# EAGLE board reg-board (EAGLE 8.7.0), part 1 of 2
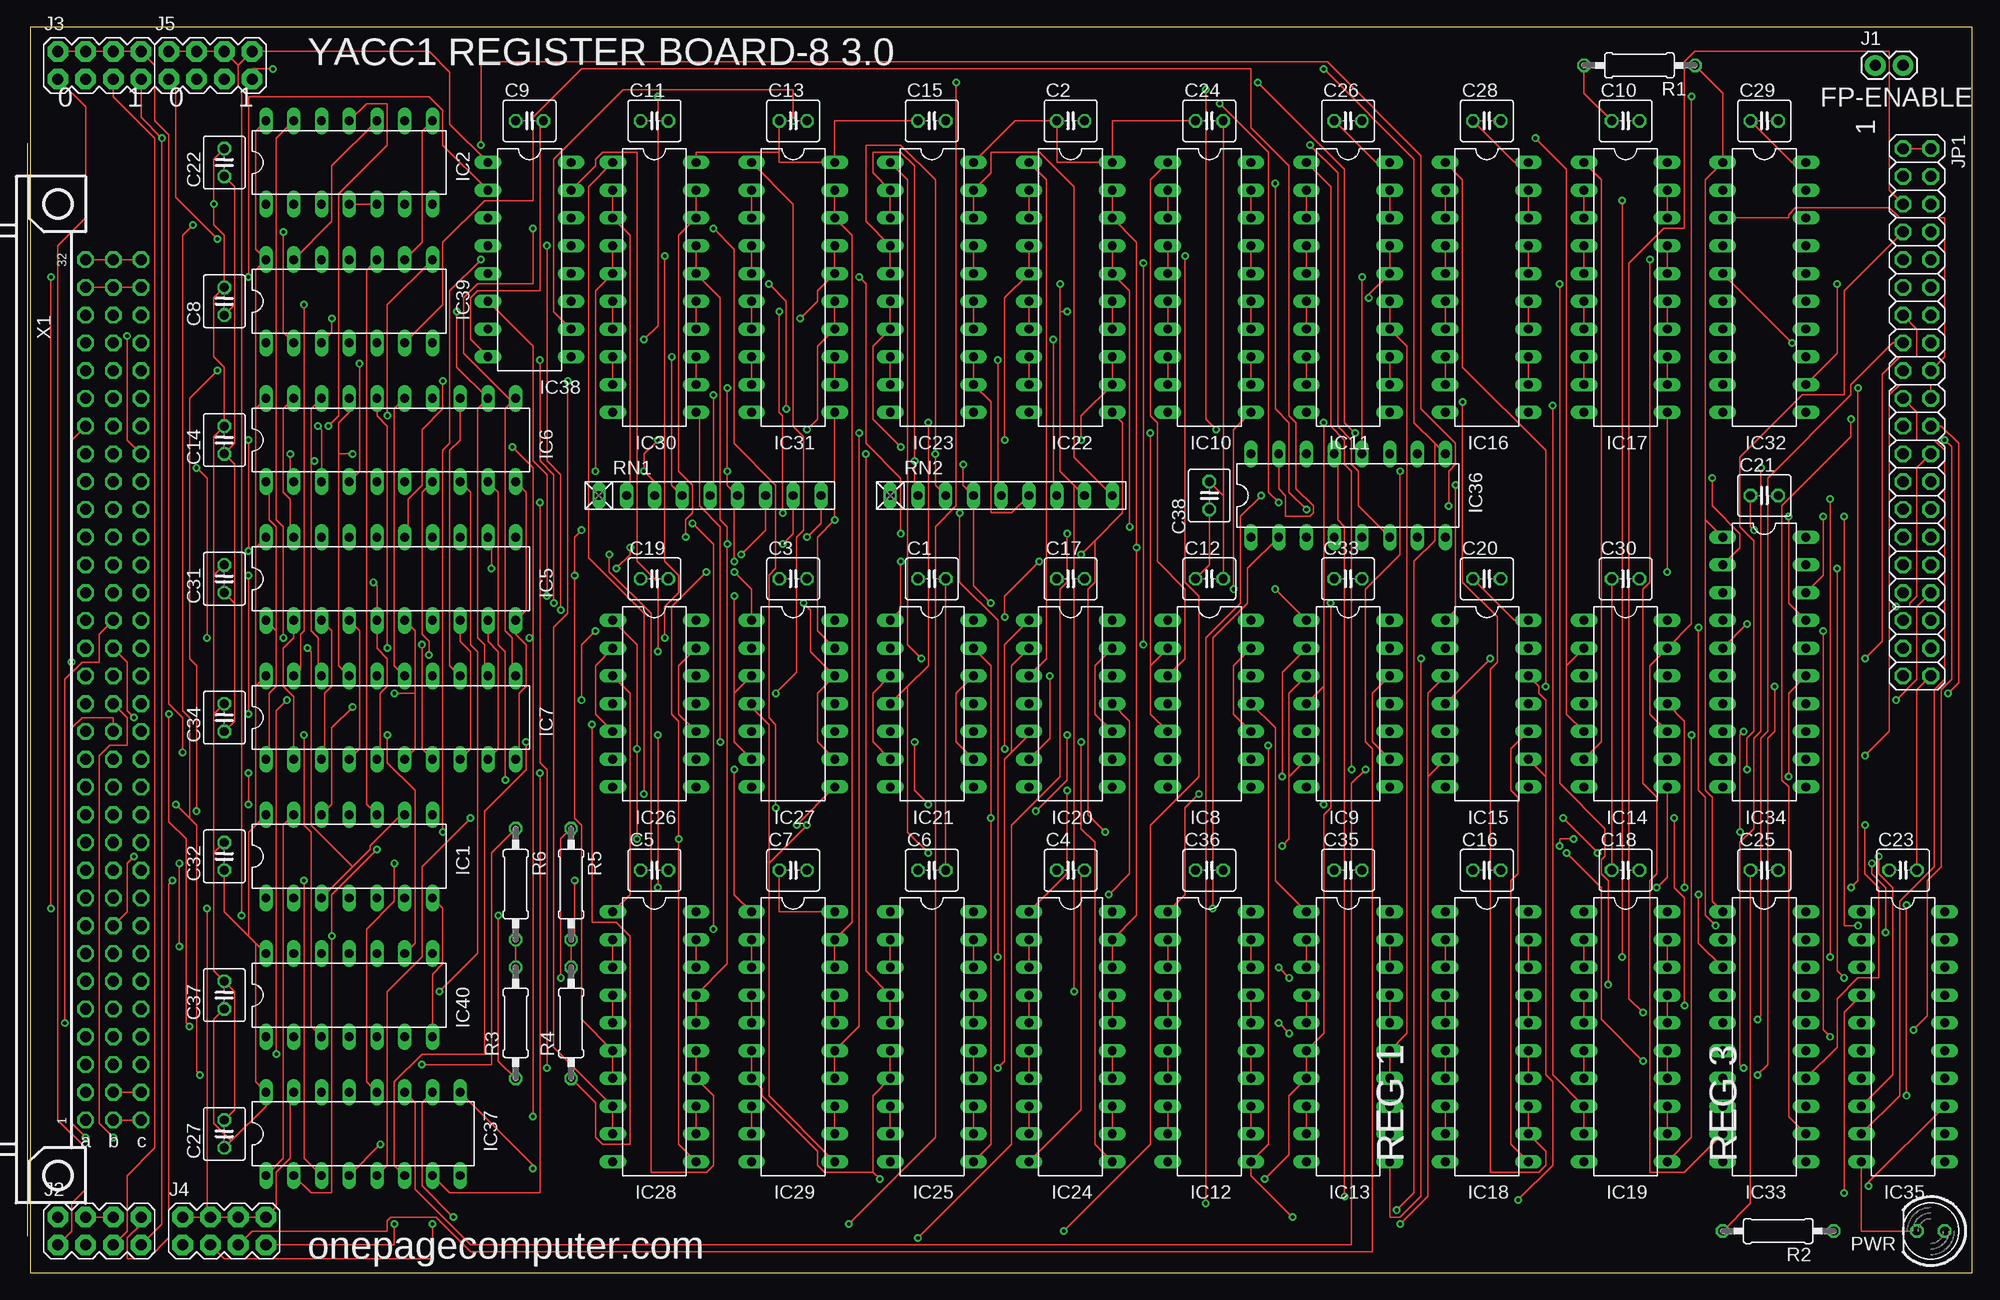
[diagram p6: board, top side]
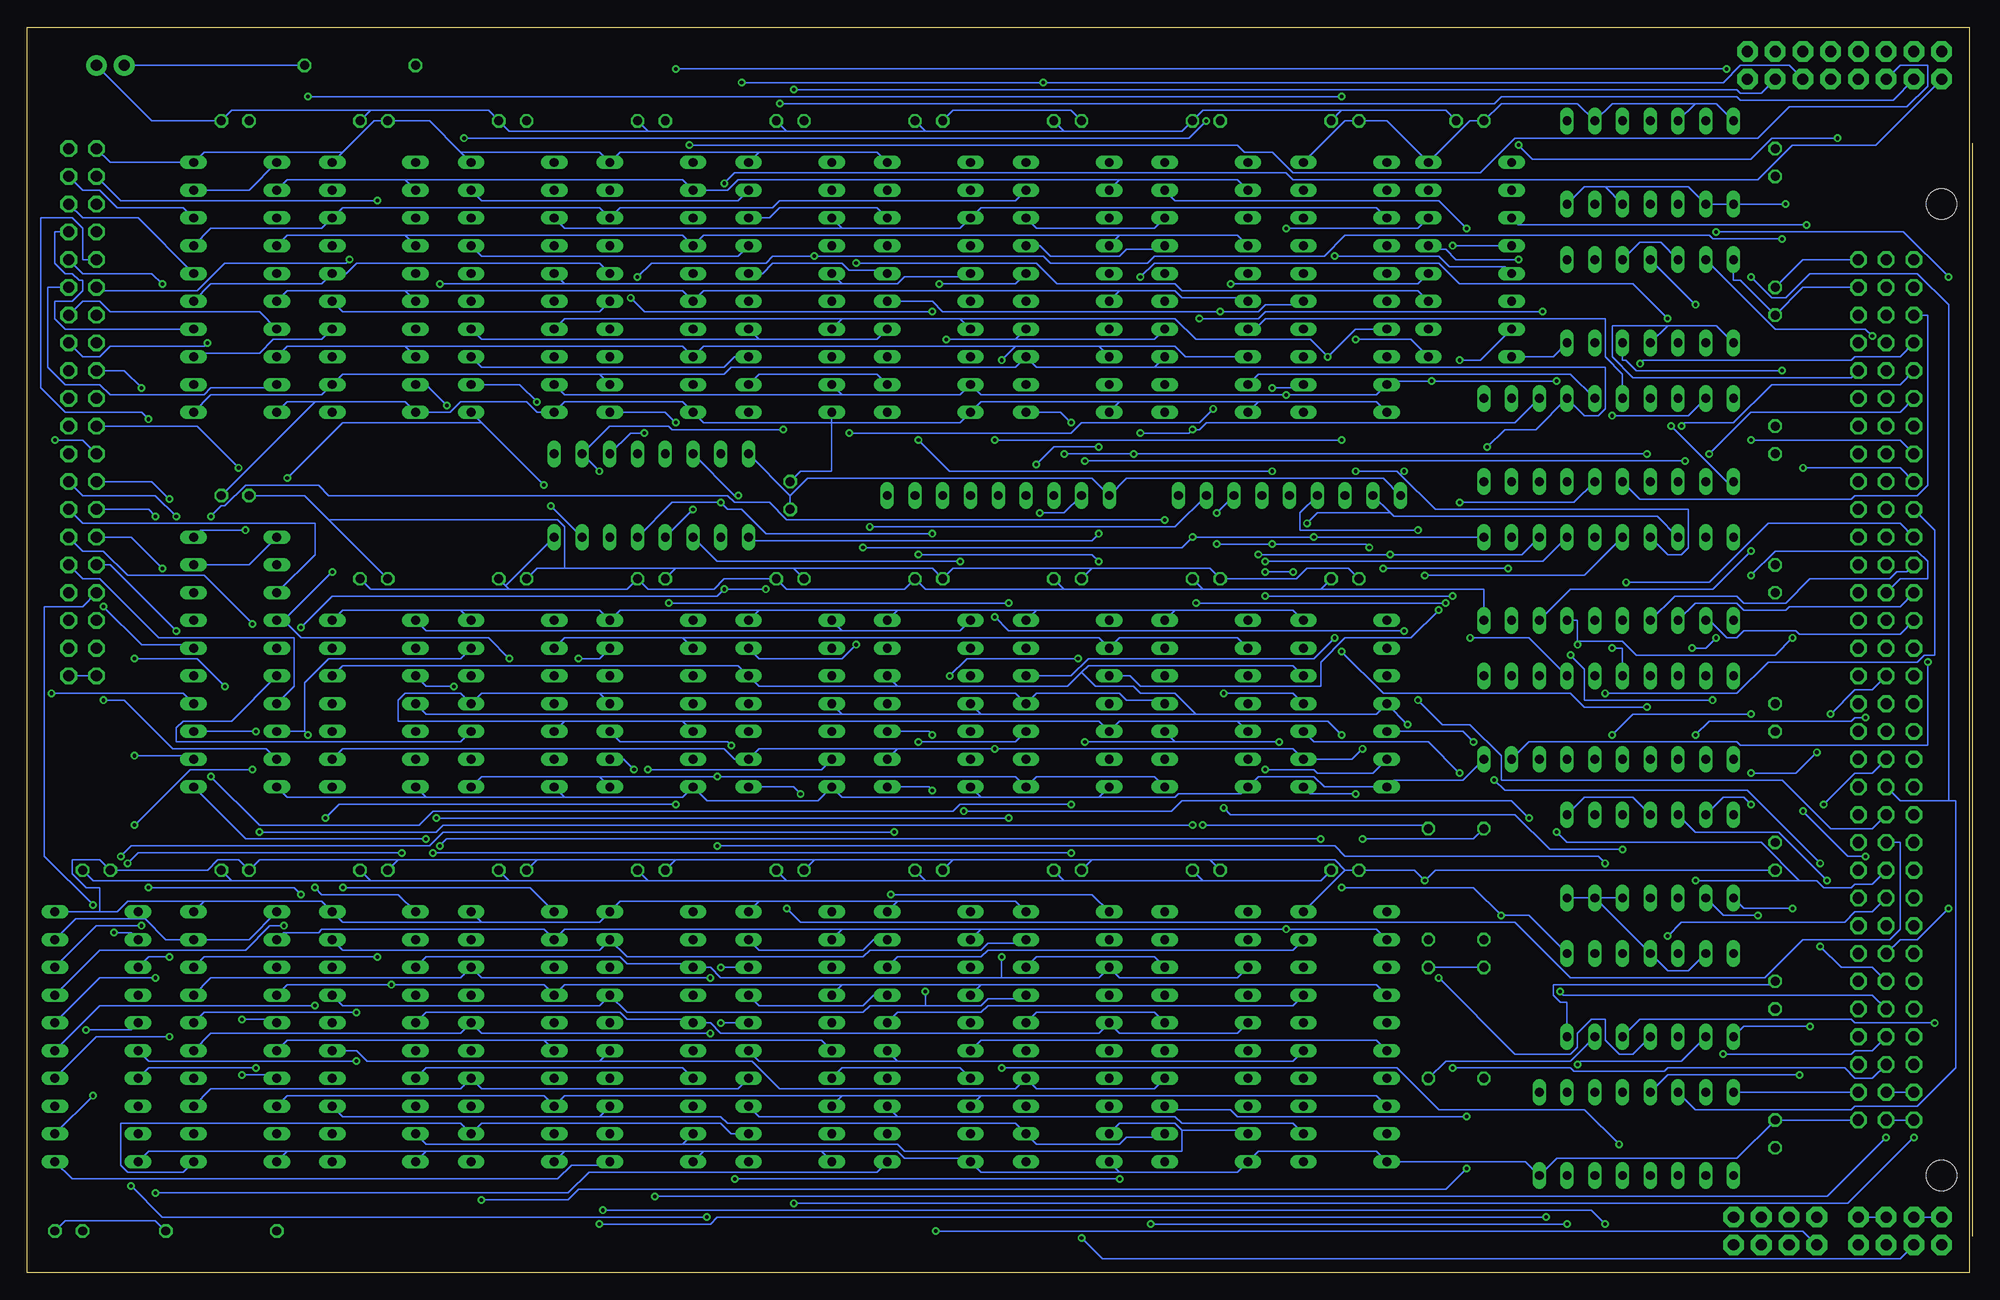
[diagram p7: board, bottom side, seen from below]

Size 177.78 x 113.97 mm. Coordinates in mm from the lower left corner, seen from the top.
Outline: 0,0 177.78,0 177.78,113.97 0,113.97 0,0
Copper layers (1*16): Top 0.0356mm / dielectric 1.5011mm / Bottom 0.0356mm
Design rules "LaenPCBOrder *": minimum track width 6mil, minimum drill 13mil, track to track 8mil, track to pad 8mil, pad to pad 8mil, via to via 8mil, smd to smd 6mil, copper to edge 40mil, drill to drill 8mil, minimum pad ring 7mil, minimum via ring 7mil, stop-mask expansion 3mil, vias tented up to drill 0mil, thermal gap 10mil
Net classes: 1 GND: width 1 mm; 2 5V: width 1 mm

## Footprints (pad centres in the part's own frame; a part is rotated, then mirrored left to right if it is on the bottom)
C025-040X050 = drill 0.813 octagon: 1 -1.27,0; 2 1.27,0
DIL14 = drill 0.813 long: 1 -7.62,-3.81; 2 -5.08,-3.81; 3 -2.54,-3.81; 4 0,-3.81; 5 2.54,-3.81; 6 5.08,-3.81; 7 7.62,-3.81; 8 7.62,3.81; 9 5.08,3.81; 10 2.54,3.81; 11 0,3.81; 12 -2.54,3.81; 13 -5.08,3.81; 14 -7.62,3.81
DIL20 = drill 0.813 long: 1 -11.43,-3.81; 2 -8.89,-3.81; 3 -6.35,-3.81; 4 -3.81,-3.81; 5 -1.27,-3.81; 6 1.27,-3.81; 7 3.81,-3.81; 8 6.35,-3.81; 9 8.89,-3.81; 10 11.43,-3.81; 11 11.43,3.81; 12 8.89,3.81; 13 6.35,3.81; 14 3.81,3.81; 15 1.27,3.81; 16 -1.27,3.81; 17 -3.81,3.81; 18 -6.35,3.81; 19 -8.89,3.81; 20 -11.43,3.81
DIL16 = drill 0.813 long: 1 -8.89,-3.81; 2 -6.35,-3.81; 3 -3.81,-3.81; 4 -1.27,-3.81; 5 1.27,-3.81; 6 3.81,-3.81; 7 6.35,-3.81; 8 8.89,-3.81; 9 8.89,3.81; 10 6.35,3.81; 11 3.81,3.81; 12 1.27,3.81; 13 -1.27,3.81; 14 -3.81,3.81; 15 -6.35,3.81; 16 -8.89,3.81
1X02 = drill 1.016 pad 1.88: 1 0,0; 2 2.54,0
2X4 = drill 1.016 pad 1.88 octagon: 1 -3.81,-1.27; 2 -3.81,1.27; 3 -1.27,-1.27; 4 -1.27,1.27; 5 1.27,-1.27; 6 1.27,1.27; 7 3.81,-1.27; 8 3.81,1.27
2X20 = drill 1.016 octagon: 1 -24.13,-1.27; 2 -24.13,1.27; 3 -21.59,-1.27; 4 -21.59,1.27; 5 -19.05,-1.27; 6 -19.05,1.27; 7 -16.51,-1.27; 8 -16.51,1.27; 9 -13.97,-1.27; 10 -13.97,1.27; 11 -11.43,-1.27; 12 -11.43,1.27; 13 -8.89,-1.27; 14 -8.89,1.27; 15 -6.35,-1.27; 16 -6.35,1.27; 17 -3.81,-1.27; 18 -3.81,1.27; 19 -1.27,-1.27; 20 -1.27,1.27; 21 1.27,-1.27; 22 1.27,1.27; 23 3.81,-1.27; 24 3.81,1.27; 25 6.35,-1.27; 26 6.35,1.27; 27 8.89,-1.27; 28 8.89,1.27; 29 11.43,-1.27; 30 11.43,1.27; 31 13.97,-1.27; 32 13.97,1.27; 33 16.51,-1.27; 34 16.51,1.27; 35 19.05,-1.27; 36 19.05,1.27; 37 21.59,-1.27; 38 21.59,1.27; 39 24.13,-1.27; 40 24.13,1.27
LED5MM = drill 0.813 octagon: A -1.27,0; K 1.27,0
0207/10 = drill 0.813 octagon: 1 -5.08,0; 2 5.08,0
RN-9 = drill 0.813 long: 1 -10.16,0; 2 -7.62,0; 3 -5.08,0; 4 -2.54,0; 5 0,0; 6 2.54,0; 7 5.08,0; 8 7.62,0; 9 10.16,0
FABC96R = drill 1.016 octagon: A1 -2.54,39.37; A2 -2.54,36.83; A3 -2.54,34.29; A4 -2.54,31.75; A5 -2.54,29.21; A6 -2.54,26.67; A7 -2.54,24.13; A8 -2.54,21.59; A9 -2.54,19.05; A10 -2.54,16.51; A11 -2.54,13.97; A12 -2.54,11.43; A13 -2.54,8.89; A14 -2.54,6.35; A15 -2.54,3.81; A16 -2.54,1.27; A17 -2.54,-1.27; A18 -2.54,-3.81; A19 -2.54,-6.35; A20 -2.54,-8.89; A21 -2.54,-11.43; A22 -2.54,-13.97; A23 -2.54,-16.51; A24 -2.54,-19.05; A25 -2.54,-21.59; A26 -2.54,-24.13; A27 -2.54,-26.67; A28 -2.54,-29.21; A29 -2.54,-31.75; A30 -2.54,-34.29; A31 -2.54,-36.83; A32 -2.54,-39.37; B1 -5.08,39.37; B2 -5.08,36.83; B3 -5.08,34.29; B4 -5.08,31.75; B5 -5.08,29.21; B6 -5.08,26.67; B7 -5.08,24.13; B8 -5.08,21.59; B9 -5.08,19.05; B10 -5.08,16.51; B11 -5.08,13.97; B12 -5.08,11.43; B13 -5.08,8.89; B14 -5.08,6.35; B15 -5.08,3.81; B16 -5.08,1.27; B17 -5.08,-1.27; B18 -5.08,-3.81; B19 -5.08,-6.35; B20 -5.08,-8.89; B21 -5.08,-11.43; B22 -5.08,-13.97; B23 -5.08,-16.51; B24 -5.08,-19.05; B25 -5.08,-21.59; B26 -5.08,-24.13; B27 -5.08,-26.67; B28 -5.08,-29.21; B29 -5.08,-31.75; B30 -5.08,-34.29; B31 -5.08,-36.83; B32 -5.08,-39.37; C1 -7.62,39.37; C2 -7.62,36.83; C3 -7.62,34.29; C4 -7.62,31.75; C5 -7.62,29.21; C6 -7.62,26.67; C7 -7.62,24.13; C8 -7.62,21.59; C9 -7.62,19.05; C10 -7.62,16.51; C11 -7.62,13.97; C12 -7.62,11.43; C13 -7.62,8.89; C14 -7.62,6.35; C15 -7.62,3.81; C16 -7.62,1.27; C17 -7.62,-1.27; C18 -7.62,-3.81; C19 -7.62,-6.35; C20 -7.62,-8.89; C21 -7.62,-11.43; C22 -7.62,-13.97; C23 -7.62,-16.51; C24 -7.62,-19.05; C25 -7.62,-21.59; C26 -7.62,-24.13; C27 -7.62,-26.67; C28 -7.62,-29.21; C29 -7.62,-31.75; C30 -7.62,-34.29; C31 -7.62,-36.83; C32 -7.62,-39.37 | hole 2.794: 0,-44.456; 0,44.456

## Placement (x,y rotation side)
C1  .1uf  [C025-040X050]  82.55,63.5 0 top
C2  .1uf  [C025-040X050]  95.25,105.41 0 top
C3  .1uf  [C025-040X050]  69.85,63.5 0 top
C4  .1uf  [C025-040X050]  95.25,36.83 0 top
C5  .1uf  [C025-040X050]  57.15,36.83 0 top
C6  .1uf  [C025-040X050]  82.55,36.83 0 top
C7  .1uf  [C025-040X050]  69.85,36.83 0 top
C8  .1uf  [C025-040X050]  17.78,88.9 90 top
C9  .1uf  [C025-040X050]  45.72,105.41 0 top
C10  .1if  [C025-040X050]  146.05,105.41 0 top
C11  .1uf  [C025-040X050]  57.15,105.41 0 top
C12  .1uf  [C025-040X050]  107.95,63.5 0 top
C13  .1uf  [C025-040X050]  69.85,105.41 0 top
C14  .1uf  [C025-040X050]  17.78,76.2 90 top
C15  .1uf  [C025-040X050]  82.55,105.41 0 top
C16  .1uf  [C025-040X050]  133.35,36.83 0 top
C17  .1uf  [C025-040X050]  95.25,63.5 0 top
C18  .1uf  [C025-040X050]  146.05,36.83 0 top
C19  .1uf  [C025-040X050]  57.15,63.5 0 top
C20  .1uf  [C025-040X050]  133.35,63.5 0 top
C21  .1uf  [C025-040X050]  158.75,71.12 0 top
C22  .1uf  [C025-040X050]  17.78,101.6 90 top
C23  .1uf  [C025-040X050]  171.45,36.83 0 top
C24  .1uf  [C025-040X050]  107.95,105.41 0 top
C25  .1uf  [C025-040X050]  158.75,36.83 0 top
C26  .1uf  [C025-040X050]  120.65,105.41 0 top
C27  .1uf  [C025-040X050]  17.78,12.7 90 top
C28  .1uf  [C025-040X050]  133.35,105.41 0 top
C29  .1uf  [C025-040X050]  158.75,105.41 0 top
C30  .1uf  [C025-040X050]  146.05,63.5 0 top
C31  .1uf  [C025-040X050]  17.78,63.5 90 top
C32  .1uf  [C025-040X050]  17.78,38.1 90 top
C33  .1uf  [C025-040X050]  120.65,63.5 0 top
C34  .1uf  [C025-040X050]  17.78,50.8 90 top
C35  .1uf  [C025-040X050]  120.65,36.83 0 top
C36  .1uf  [C025-040X050]  107.95,36.83 0 top
C37  .1uf  [C025-040X050]  17.78,25.4 90 top
C38  .1uf  [C025-040X050]  107.95,71.12 90 top
IC1  74LS266N  [DIL14]  29.21,38.1 0 top
IC2  74LS86N  [DIL14]  29.21,101.6 0 top
IC5  74LS245N  [DIL20]  33.02,63.5 0 top
IC6  74LS245N  [DIL20]  33.02,76.2 0 top
IC7  74LS245N  [DIL20]  33.02,50.8 0 top
IC8  7432N  [DIL14]  107.95,52.07 270 top
IC9  74LS02N  [DIL14]  120.65,52.07 270 top
IC10  74S374N  [DIL20]  107.95,90.17 270 top
IC11  74S374N  [DIL20]  120.65,90.17 270 top
IC12  74S374N  [DIL20]  107.95,21.59 270 top
IC13  74S374N  [DIL20]  120.65,21.59 270 top
IC14  7432N  [DIL14]  146.05,52.07 270 top
IC15  74LS02N  [DIL14]  133.35,52.07 270 top
IC16  74S374N  [DIL20]  133.35,90.17 270 top
IC17  74S374N  [DIL20]  146.05,90.17 270 top
IC18  74S374N  [DIL20]  133.35,21.59 270 top
IC19  74S374N  [DIL20]  146.05,21.59 270 top
IC20  7432N  [DIL14]  95.25,52.07 270 top
IC21  74LS02N  [DIL14]  82.55,52.07 270 top
IC22  74S374N  [DIL20]  95.25,90.17 270 top
IC23  74S374N  [DIL20]  82.55,90.17 270 top
IC24  74S374N  [DIL20]  95.25,21.59 270 top
IC25  74S374N  [DIL20]  82.55,21.59 270 top
IC26  7432N  [DIL14]  57.15,52.07 270 top
IC27  74LS02N  [DIL14]  69.85,52.07 270 top
IC28  74S374N  [DIL20]  57.15,21.59 270 top
IC29  74S374N  [DIL20]  69.85,21.59 270 top
IC30  74S374N  [DIL20]  57.15,90.17 270 top
IC31  74S374N  [DIL20]  69.85,90.17 270 top
IC32  74LS244N  [DIL20]  158.75,90.17 270 top
IC33  74LS244N  [DIL20]  158.75,21.59 270 top
IC34  74LS244N  [DIL20]  158.75,55.88 270 top
IC35  74LS244N  [DIL20]  171.45,21.59 270 top
IC36  74LS139N  [DIL16]  120.65,71.12 0 top
IC37  74LS139N  [DIL16]  30.48,12.7 0 top
IC38  74LS139N  [DIL16]  45.72,92.71 270 top
IC39  74LS32N  [DIL14]  29.21,88.9 0 top
IC40  74LS07N  [DIL14]  29.21,25.4 0 top
J1  [1X02]  168.91,110.49 0 top
J2  [2X4]  6.35,3.81 0 top
J3  [2X4]  6.35,110.49 0 top
J4  [2X4]  17.78,3.81 0 top
J5  [2X4]  16.51,110.49 0 top
JP1  [2X20]  172.72,78.74 270 top
PWR  [LED5MM]  173.99,3.81 180 top
R1  10k  [0207/10]  147.32,110.49 180 top
R2  330  [0207/10]  160.02,3.81 180 top
R3  10k  [0207/10]  44.45,22.86 90 top
R4  10k  [0207/10]  49.53,22.86 90 top
R5  10k  [0207/10]  49.53,35.56 270 top
R6  10k  [0207/10]  44.45,35.56 270 top
RN1  10k  [RN-9]  62.23,71.12 0 top
RN2  10k  [RN-9]  88.9,71.12 0 top
X1  FABC96R  [FABC96R]  2.54,53.34 180 top

## Tracks (layer width: path | path; a pad name or v marks a point on that pad's centre or on a via)
-BUS-EN
  Bottom 0.152: IC39.1 23.18,86.68 27.62,86.68 | IC39.4 27.62,86.68 | X1.C28 10.79,81.92 30.8,81.92 32.7,83.82 32.7,86.68 27.62,86.68
-HL-SWAP  (via drill 0.33)
  Top 0.152: IC39.13 27.62,96.2 27.62,101.28 IC2.10 | X1.C25 8.89,76.2 v8.89,85.72
  Bottom 0.152: v8.89,85.72 9.53,86.36 17.78,86.36 IC39.13
-LD-SEL0  (via drill 0.33)
  Top 0.152: IC37.15 23.81,16.19 23.81,10.48 22.54,9.21 22.54,6.03 J4.8 J4.6 J4.4 16.19,5.4 | 16.19,5.4 v16.19,33.34 | J4.2 16.19,5.08 16.19,5.4
  Bottom 0.152: IC1.1 20.64,33.34 v16.19,33.34
-LD-SEL1  (via drill 0.33)
  Top 0.152: IC38.1 38.42,105.09 38.42,109.86 36.51,111.76 J5.8 19.05,110.49 | J5.2 J5.4 J5.6 19.05,110.49 | v19.37,32.7 19.37,108.27 19.05,108.58 19.05,110.49
  Bottom 0.152: IC1.2 22.54,32.7 v19.37,32.7
-LDSEL  (via drill 0.33)
  Top 0.152: 29.53,37.15 31.11,38.73 31.11,39.05 33.97,41.91 IC1.9 | 29.53,37.15 IC1.3 | IC2.13 22.54,103.82 22.54,68.9 23.18,68.26 v23.18,58.1 | v25.4,57.15 25.72,56.83 25.72,40.96 29.53,37.15
  Bottom 0.152: v23.18,58.1 24.13,57.15 v25.4,57.15
-R0-LDSEL  (via drill 0.33)
  Top 0.152: IC37.12 30.8,17.46 30.8,31.43 33.34,33.97 v33.34,37.47 | v114.62,39.05 115.25,39.69 115.25,45.4 | IC9.6 115.25,45.4 | IC9.3 115.25,53.02 115.25,45.4
  Bottom 0.152: v33.34,37.47 33.97,38.1 57.15,38.1 58.1,39.05 v114.62,39.05
-R0-RDSEL  (via drill 0.33)
  Top 0.152: IC8.5 102.55,51.12 102.55,55.56 | IC8.2 102.55,55.56 | v67.63,90.49 69.22,88.9 v69.22,79.06 | 102.55,55.56 v102.55,76.83
  Bottom 0.152: IC38.12 50.48,90.49 v67.63,90.49 | v69.22,79.06 70.48,77.79 81.28,77.79 82.23,76.83 v102.55,76.83
-R1-LDSEL  (via drill 0.33)
  Top 0.152: IC37.11 35.24,15.56 35.24,7.62 40.32,2.54 120.97,2.54 120.97,44.77 v122.24,46.04 | IC9.12 122.87,53.02 122.87,48.58 IC9.9
  Bottom 0.152: v122.24,46.04 123.19,46.99 IC9.9
-R1-RDSEL  (via drill 0.33)
  Top 0.152: IC8.10 110.17,51.12 110.17,55.56 IC8.13 | v101.92,57.47 v101.92,92.39
  Bottom 0.152: IC38.11 50.48,89.85 72.07,89.85 72.71,90.49 83.5,90.49 85.41,92.39 v101.92,92.39 | v101.92,57.47 103.19,56.2 110.81,56.2 IC8.13
-R2-LDSEL  (via drill 0.33)
  Top 0.152: IC37.10 35.88,15.56 35.88,7.94 v38.73,5.08 | v125.41,4.45 127.95,6.99 127.95,45.4 | IC15.6 127.95,45.4 | IC15.3 127.95,53.02 127.95,45.4
  Bottom 0.152: v38.73,5.08 114.62,5.08 115.25,4.45 v125.41,4.45
-R2-RDSEL  (via drill 0.33)
  Top 0.152: IC14.5 140.65,51.12 140.65,55.56 | IC14.2 140.65,55.56 | IC38.10 47.94,87.95 47.94,101.92 54.29,108.27 69.85,108.27 v69.85,105.41 | v137.79,103.82 140.65,100.97 140.65,55.56
  Bottom 0.152: v69.85,105.41 71.44,103.82 v137.79,103.82
-R3-LDSEL  (via drill 0.33)
  Top 0.152: IC37.9 46.04,9.84 v46.04,9.53 | v136.21,6.67 139.38,9.84 139.38,17.46 138.75,18.1 138.75,45.4 | IC15.9 138.75,45.4 | IC15.12 138.11,53.66 138.11,53.02 138.75,52.39 138.75,45.4
  Bottom 0.152: v46.04,9.53 47.94,7.62 127.32,7.62 128.27,6.67 v136.21,6.67
-R3-RDSEL  (via drill 0.33)
  Top 0.152: IC14.10 148.27,51.12 148.27,55.56 IC14.13 152.08,59.37 v152.08,107.63 | v56.2,85.41 57.47,86.68 v57.47,107.63
  Bottom 0.152: IC38.9 51.12,85.41 v56.2,85.41 | v152.08,107.63 v57.47,107.63
-R4-LDSEL  (via drill 0.33)
  Top 0.152: IC21.6 77.15,48.58 77.15,53.02 IC21.3 | v47.31,93.98 47.31,74.3 48.58,73.03 v48.58,60.64
  Bottom 0.152: v47.31,93.98 IC38.4 | v48.58,60.64 51.12,58.1 57.15,58.1 59.37,55.88 59.37,53.66 75.88,53.66 76.83,54.61 IC21.3
-R4-RDSEL  (via drill 0.33)
  Top 0.152: v32.07,11.75 IC37.4 | v88.58,18.73 89.22,19.37 89.22,46.99 89.85,47.62 | 89.85,47.62 91.44,49.21 IC20.5 | IC20.2 89.85,55.56 89.85,47.62
  Bottom 0.152: v32.07,11.75 35.24,14.92 48.58,14.92 52.39,18.73 v88.58,18.73
-R5-LDSEL  (via drill 0.33)
  Top 0.152: IC21.9 84.77,48.58 84.77,53.02 IC21.12 | v58.1,93.03 58.1,65.09 59.37,63.82 59.37,62.23 58.1,60.96 v58.1,58.1
  Bottom 0.152: IC38.5 42.55,92.08 47.62,92.08 48.58,93.03 v58.1,93.03 | v58.1,58.1 60.01,56.2 80.64,56.2 82.23,54.61 IC21.12
-R5-RDSEL  (via drill 0.33)
  Top 0.152: IC37.5 32.7,9.84 32.7,25.72 35.88,28.89 35.88,37.15 v40.32,41.59 | v92.08,42.23 94.93,45.09 v94.93,49.21 | IC20.13 97.47,55.56 97.47,51.12 IC20.10
  Bottom 0.152: v40.32,41.59 41.91,43.18 72.07,43.18 73.03,42.23 v92.08,42.23 | v94.93,49.21 95.25,49.53 IC20.10
-R6-LDSEL  (via drill 0.33)
  Top 0.152: IC27.6 64.45,48.58 64.45,53.02 | IC27.3 64.45,53.02 | IC38.6 46.04,84.77 46.04,74.3 47.31,73.03 v47.31,61.91 | 64.45,53.02 v64.45,61.91
  Bottom 0.152: v64.45,61.91 v47.31,61.91
-R6-RDSEL  (via drill 0.33)
  Top 0.152: IC37.6 33.34,9.84 33.34,17.46 35.88,20 41.59,20 41.59,42.23 45.4,46.04 v45.4,48.58 | IC26.2 51.75,55.56 51.75,51.12 IC26.5
  Bottom 0.152: v45.4,48.58 46.35,49.53 IC26.5
-R7-LDSEL  (via drill 0.33)
  Top 0.152: IC27.9 72.07,48.58 72.07,53.02 IC27.12 71.44,56.83 71.44,60.64 v70.8,61.28 | v46.67,83.5 46.67,74.3 47.94,73.03 v47.94,61.28
  Bottom 0.152: IC38.7 44.77,83.5 v46.67,83.5 | v70.8,61.28 v47.94,61.28
-R7-RDSEL  (via drill 0.33)
  Top 0.152: IC37.7 38.42,7.3 46.67,7.3 v46.67,45.72 | IC26.13 59.37,55.56 59.37,51.12 IC26.10
  Bottom 0.152: v46.67,45.72 49.53,48.58 60.01,48.58 IC26.10
-RD-SEL0  (via drill 0.33)
  Top 0.152: J2.4 J2.6 | v13.02,35.88 12.7,35.56 12.7,3.17 10.79,1.27 8.89,1.27 8.89,3.17 10.16,4.45 J2.8 | IC38.15 51.75,101.28 51.75,101.92 52.39,102.55 55.56,102.55 55.56,65.09 57.47,63.18 v57.47,56.83 | v29.53,51.75 27.62,49.85 27.62,42.86 IC1.12
  Bottom 0.152: J2.4 J2.2 | IC1.12 25.08,40.32 17.46,40.32 v13.02,35.88 | v57.47,56.83 53.66,53.02 36.51,53.02 35.24,51.75 v29.53,51.75 | J2.8 J2.6
-RD-SEL1  (via drill 0.33)
  Top 0.152: J3.2 J3.4 J3.6 J3.8 11.43,110.49 11.43,105.41 12.7,104.14 12.7,52.07 13.97,50.8 v13.97,47.62 | IC37.1 23.18,10.48 23.18,40.96 IC1.13 | v20,42.86 v20,45.72
  Bottom 0.152: v13.97,47.62 15.88,45.72 v20,45.72 | v20,42.86 20.64,43.5 22.54,43.5 IC1.13
-RDSEL
  Bottom 0.152: IC1.11 30.8,43.5 35.24,43.5 IC1.8
-REG-FUNC-LD  (via drill 0.33)
  Top 0.152: v17.14,82.55 14.61,80.01 14.61,56.2 15.24,55.56 v15.24,42.23 | v9.53,38.1 8.89,37.47 8.89,33.02 X1.B8
  Bottom 0.152: IC39.5 31.75,83.5 31.43,83.5 30.48,82.55 v17.14,82.55 | v15.24,42.23 11.11,38.1 v9.53,38.1
-REG-FUNC-RD  (via drill 0.33)
  Top 0.152: IC39.2 23.18,86.04 v23.18,95.25 | v1.91,33.34 v1.91,91.12
  Bottom 0.152: v23.18,95.25 6.03,95.25 v1.91,91.12 | v1.91,33.34 4.76,30.48 6.35,30.48 X1.B7
-REG-LD-HI  (via drill 0.33)
  Top 0.152: IC40.9 35.24,30.16 35.24,44.13 32.7,46.67 v32.7,49.21 | v20,63.82 v20,51.12
  Bottom 0.152: v32.7,49.21 30.8,51.12 v20,51.12 | v20,63.82 17.78,66.04 4.76,66.04 3.81,65.09 3.81,63.5 6.35,63.5 X1.B20
-REG-LD-LO  (via drill 0.33)
  Top 0.152: IC40.3 25.72,22.54 25.72,40.32 25.08,40.96 v25.08,49.21 | v9.53,50.8 8.89,51.44 8.89,55.88 X1.B18
  Bottom 0.152: v25.08,49.21 23.81,50.48 10.79,50.48 10.48,50.8 v9.53,50.8
-REG-RD-HI  (via drill 0.33)
  Top 0.152: v3.17,22.86 3.17,54.29 4.76,55.88 6.35,55.88 6.35,58.42 X1.B19
  Bottom 0.152: IC40.5 30.16,23.18 10.79,23.18 10.48,22.86 v3.17,22.86
-REG-RD-LO  (via drill 0.33)
  Top 0.152: v14.61,22.54 14.29,22.86 14.29,39.69 12.7,41.27 v12.7,51.12
  Bottom 0.152: IC40.1 20.64,22.54 v14.61,22.54 | v12.7,51.12 10.48,53.34 8.89,53.34 X1.B17
-RLDH  (via drill 0.33)
  Top 0.152: R3.1 42.86,19.37 v42.86,32.7 | v57.47,49.21 v57.47,35.24
  Bottom 0.152: IC27.11 73.98,52.39 77.15,52.39 77.79,53.02 85.41,53.02 IC21.11 87.31,53.02 125.41,53.02 | 125.41,53.02 IC9.11 | 125.41,53.02 136.21,53.02 IC15.11 138.11,53.02 143.19,53.02 143.83,52.39 143.83,50.48 128.59,50.48 | IC40.8 40.32,32.7 v42.86,32.7 45.4,35.24 v57.47,35.24 | 66.99,50.48 IC27.5 | 66.99,50.48 77.79,50.48 IC21.5 79.69,50.48 117.79,50.48 | 117.79,50.48 IC9.5 | 128.59,50.48 117.79,50.48 | IC15.5 128.59,50.48 | v57.47,49.21 58.74,50.48 66.99,50.48
-RLDL  (via drill 0.33)
  Top 0.152: v48.58,26.99 48.58,39.69 R5.1 | IC27.8 v70.17,40.96 | IC9.2 114.62,54.93 v114.62,45.4
  Bottom 0.152: IC27.2 66.99,58.1 77.79,58.1 IC21.2 79.69,58.1 117.79,58.1 | 117.79,58.1 IC9.2 | 117.79,58.1 128.59,58.1 IC15.2 | IC40.4 30.8,20 32.07,20 33.34,21.27 33.34,23.18 34.61,23.18 35.88,21.91 35.88,20.64 36.51,20 41.59,20 v48.58,26.99 | IC27.8 74.61,45.4 85.41,45.4 IC21.8 87.31,45.4 v114.62,45.4 125.41,45.4 | 125.41,45.4 IC9.8 | 125.41,45.4 136.21,45.4 IC15.8 | R5.1 49.85,40.96 v70.17,40.96
-RRDH  (via drill 0.33)
  Top 0.152: R4.1 51.75,15.56 51.75,12.38 52.39,11.75 54.93,11.75 54.93,30.8 53.66,32.07 51.44,32.07 v51.44,50.16
  Bottom 0.152: IC26.12 61.91,55.56 80.64,55.56 81.28,54.93 | 81.28,54.93 82.55,53.66 98.11,53.66 | IC20.12 98.11,53.66 | 98.11,53.66 110.81,53.66 IC8.12 112.71,55.56 148.91,55.56 IC14.12 | IC40.6 36.51,19.37 47.94,19.37 R4.1 | 90.49,51.12 70.8,51.12 | 70.8,51.12 54.29,51.12 IC26.4 v51.44,50.16 | IC20.4 90.49,51.12 | 103.19,51.12 IC8.4 | 90.49,51.12 103.19,51.12 | IC14.4 141.29,51.12 103.19,51.12 | 81.28,54.93 80.01,53.66 76.52,53.66 75.88,53.02 72.71,53.02 70.8,51.12
-RRDL  (via drill 0.33)
  Top 0.152: v35.88,19.05 42.23,19.05 42.23,38.42 R6.1 | IC26.1 55.56,57.47 v55.56,47.94 v55.56,39.69 | IC20.1 89.22,57.47 v89.22,47.94
  Bottom 0.152: IC20.1 92.39,58.74 103.19,58.74 | IC8.1 103.19,58.74 | IC14.1 141.29,58.74 103.19,58.74 | IC40.2 26.35,19.37 35.56,19.37 v35.88,19.05 | 98.11,47.94 v89.22,47.94 61.91,47.94 IC26.9 56.52,46.99 v55.56,47.94 | IC20.9 98.11,47.94 | 98.11,47.94 110.81,47.94 IC8.9 113.03,46.99 113.98,47.94 148.91,47.94 IC14.9 | R6.1 45.4,39.69 v55.56,39.69
ADATA0  (via drill 0.33)
  Top 0.152: IC18.2 IC18.3 | IC12.2 IC12.3 | IC28.2 IC28.3 | IC24.2 IC24.3 | IC16.2 IC16.3 | IC22.2 IC22.3 | IC10.2 IC10.3 | IC30.2 IC30.3 54.93,94.93 54.93,71.44 RN1.2 | v62.55,31.43 62.55,66.67 v60.64,68.58
  Bottom 0.152: IC33.2 154.31,31.11 151.13,31.11 150.81,31.43 130.49,31.43 IC18.2 128.59,31.43 103.19,31.43 | IC28.2 54.29,31.43 v62.55,31.43 90.49,31.43 | IC24.2 90.49,31.43 | 103.19,31.43 IC12.2 | 90.49,31.43 103.19,31.43 | 103.19,95.57 92.39,95.57 IC22.3 90.49,97.47 54.29,97.47 IC30.3 | IC10.3 103.19,95.57 | IC16.3 128.59,95.57 103.19,95.57 | IC5.18 28.57,69.22 52.7,69.22 53.02,69.53 | RN1.2 53.02,69.53 | v60.64,68.58 59.69,69.53 53.02,69.53
ADATA1  (via drill 0.33)
  Top 0.152: IC18.4 IC18.5 | IC12.4 IC12.5 | IC28.4 IC28.5 | IC24.4 IC24.5 | IC16.4 IC16.5 | IC22.4 IC22.5 89.22,89.22 v89.22,76.2 | IC10.4 IC10.5 | IC30.4 IC30.5 51.75,89.85 v51.75,73.34 | RN1.3 57.15,72.39 v56.2,73.34 56.2,74.93 v57.47,76.2 | v144.46,26.35 144.46,35.88 143.83,36.51 143.83,37.78 144.15,38.1 144.15,40.64 140.02,44.77 v140.02,90.49
  Bottom 0.152: IC33.4 153.99,26.35 v144.46,26.35 130.49,26.35 IC18.4 128.59,26.35 103.19,26.35 | IC28.4 54.29,26.35 90.49,26.35 | IC24.4 90.49,26.35 | 103.19,26.35 IC12.4 | 90.49,26.35 103.19,26.35 | IC22.5 91.76,91.12 97.47,91.12 98.11,90.49 103.19,90.49 | IC10.5 103.19,90.49 | 128.59,90.49 IC16.5 | 103.19,90.49 128.59,90.49 | IC5.17 27.62,65.72 26.35,65.72 25.72,66.36 25.72,69.85 48.9,69.85 52.07,73.03 | 52.07,73.03 52.39,73.34 v56.2,73.34 | 52.07,73.03 v51.75,73.34 | v57.47,76.2 v89.22,76.2 | 128.59,90.49 v140.02,90.49
ADATA2  (via drill 0.33)
  Top 0.152: IC30.6 IC30.7 | RN1.4 58.74,72.07 v58.74,83.82 | IC16.6 IC16.7 | IC22.6 IC22.7 | IC10.6 IC10.7 | IC24.6 IC24.7 | IC12.6 IC12.7 | IC18.6 IC18.7 | IC28.7 IC28.6 50.48,23.18 50.48,40.96 49.85,41.59 v49.85,63.82 49.85,67.31 v50.48,67.94
  Bottom 0.152: IC30.7 56.2,86.36 v58.74,83.82 60.33,85.41 70.8,85.41 72.71,87.31 92.39,87.31 | 92.39,87.31 IC22.7 | 103.19,87.31 92.39,87.31 | IC10.7 103.19,87.31 | IC16.7 128.59,87.31 103.19,87.31 | IC24.7 92.39,18.73 103.19,18.73 IC12.7 | IC33.6 153.99,21.27 130.49,21.27 | IC18.6 130.49,21.27 | IC12.6 105.09,21.27 130.49,21.27 | IC5.16 35.24,63.82 v49.85,63.82 | IC24.6 90.49,21.27 54.29,21.27 IC28.6 | RN1.4 61.28,69.53 61.28,67.94 v50.48,67.94
ADATA3  (via drill 0.33)
  Top 0.152: IC18.8 IC18.9 | IC12.8 IC12.9 | IC28.9 IC28.8 47.94,20.64 47.94,59.05 49.21,60.33 v49.21,81.6 | IC24.8 IC24.9 | IC16.8 IC16.9 | IC22.8 IC22.9 | IC10.8 IC10.9 | IC5.15 34.61,67.63 34.61,70.8 35.88,72.07 35.88,77.15 37.78,79.06 v37.78,81.6 | RN1.5 62.55,71.44 v62.55,80.33 | IC30.9 IC30.8
  Bottom 0.152: IC33.8 153.99,16.19 130.49,16.19 IC18.8 128.59,16.19 103.19,16.19 | IC28.8 54.29,16.19 90.49,16.19 | IC24.8 90.49,16.19 | 103.19,16.19 IC12.8 | 90.49,16.19 103.19,16.19 | 103.19,80.33 92.39,80.33 IC22.9 90.49,80.33 v62.55,80.33 54.29,80.33 IC30.9 53.02,81.6 v49.21,81.6 v37.78,81.6 | IC10.9 103.19,80.33 | IC16.9 128.59,80.33 103.19,80.33
ADATA4  (via drill 0.33)
  Top 0.152: IC18.13 IC18.12 138.75,11.11 138.75,9.84 138.11,9.21 133.67,9.21 133.67,55.24 134.3,55.88 134.3,60.01 131.13,63.18 v131.13,79.69 | IC12.13 IC12.12 | IC28.13 IC28.12 | IC24.13 IC24.12 | IC16.13 IC16.12 | IC22.13 IC22.12 96.2,78.42 v96.2,76.2 | IC10.13 IC10.12 | IC30.13 IC30.12 | v64.45,65.09 64.45,70.8 RN1.6 63.82,72.07 v63.82,73.34 v63.82,80.96
  Bottom 0.152: IC33.11 163.51,9.21 168.59,9.21 169.23,9.84 169.23,13.65 138.11,13.65 IC18.12 136.21,13.65 114.3,13.65 113.35,12.7 IC12.12 | IC28.12 61.91,13.65 72.07,13.65 72.71,14.29 98.11,14.29 | IC24.13 98.11,14.29 | IC12.13 110.81,14.29 98.11,14.29 | IC22.12 100.01,82.23 110.81,82.23 IC10.12 | IC16.13 136.21,82.87 113.98,82.87 113.03,83.82 IC10.13 | IC5.14 39.05,65.09 v64.45,65.09 | IC30.12 61.28,80.96 v63.82,80.96 | v96.2,76.2 93.34,73.34 v63.82,73.34 | v131.13,79.69 132.72,81.28 IC16.12
ADATA5  (via drill 0.33)
  Top 0.152: IC18.15 IC18.14 | IC12.15 IC12.14 | IC28.15 IC28.14 62.55,16.19 62.55,9.84 61.91,9.21 56.83,9.21 56.83,60.33 53.02,64.14 v53.02,65.72 | IC24.15 IC24.14 | v65.09,65.72 67.31,67.94 RN1.7 | IC16.15 IC16.14 | IC10.15 IC10.14 | IC30.15 IC30.14 | IC22.15 IC22.14 | v68.9,69.53 68.9,78.42 68.58,78.74 v68.58,87.95
  Bottom 0.152: IC33.13 160.97,16.83 138.11,16.83 IC18.14 136.21,16.83 112.71,16.83 IC12.14 | IC28.15 61.91,19.37 98.11,19.37 | IC24.15 98.11,19.37 | IC12.15 110.81,19.37 98.11,19.37 | IC5.13 40.96,65.72 v53.02,65.72 v65.09,65.72 | IC30.15 61.28,88.58 64.45,88.58 65.09,87.95 v68.58,87.95 93.98,87.95 94.93,88.9 IC22.15 | 110.81,85.41 IC10.14 | 110.81,85.41 100.01,85.41 IC22.14 | IC16.14 136.21,85.41 110.81,85.41 | v68.9,69.53 RN1.7
ADATA6  (via drill 0.33)
  Top 0.152: IC18.17 IC18.16 | IC12.17 IC12.16 | IC28.16 IC28.17 63.82,28.26 v63.82,66.67 63.82,68.26 63.18,68.9 63.18,89.22 IC30.16 IC30.17 | IC24.17 IC24.16 | v114.3,22.86 v115.25,21.91 | IC16.17 IC16.16 | IC22.17 IC22.16 100.65,89.85 v100.65,68.26 | IC10.17 IC10.16 | IC5.12 42.23,66.99 v42.23,64.45 | v53.66,64.45 54.93,65.72 v54.93,66.36 | v68.9,66.67 69.85,67.63 RN1.8
  Bottom 0.152: IC33.15 160.97,21.91 138.11,21.91 IC18.16 136.21,21.91 v115.25,21.91 | IC28.17 61.91,24.45 89.85,24.45 90.49,23.81 98.11,23.81 IC24.16 | IC12.17 110.81,24.45 101.28,24.45 100.33,25.4 IC24.17 | IC12.16 v114.3,22.86 | IC22.16 99.38,91.76 102.55,91.76 103.19,92.39 109.54,92.39 110.49,91.44 IC10.16 | IC16.17 136.21,93.03 112.71,93.03 IC10.17 | v53.66,64.45 v42.23,64.45 | v54.93,66.36 55.24,66.67 v63.82,66.67 v68.9,66.67 | v100.65,68.26 72.71,68.26 RN1.8
ADATA7  (via drill 0.33)
  Top 0.152: IC30.19 IC30.18 59.37,94.93 59.37,73.34 60.64,72.07 60.64,69.53 60.01,68.9 v60.01,67.31 | v71.12,67.31 72.39,68.58 RN1.9 | IC16.19 IC16.18 | IC22.19 IC22.18 101.28,94.3 v101.28,66.36 101.28,32.7 IC24.19 IC24.18 | IC10.19 IC10.18 | IC18.19 IC18.18 | IC12.19 IC12.18 | IC28.19 IC28.18 | v114.3,27.94 v115.25,26.99
  Bottom 0.152: IC5.11 v60.01,67.31 v71.12,67.31 72.07,66.36 v101.28,66.36 | IC22.18 100.01,97.47 108.9,97.47 109.86,96.52 IC10.18 | IC16.19 136.21,98.11 112.71,98.11 IC10.19 | IC33.17 160.97,26.99 138.11,26.99 IC18.18 136.21,26.99 v115.25,26.99 | IC28.19 61.91,29.53 89.85,29.53 90.49,28.89 98.11,28.89 IC24.18 | IC12.19 110.81,29.53 101.28,29.53 100.33,30.48 IC24.19 | IC12.18 v114.3,27.94
ADATA8  (via drill 0.33)
  Top 0.152: IC29.2 IC29.3 | IC25.2 IC25.3 | IC13.2 IC13.3 | IC19.2 IC19.3 | IC11.2 IC11.3 | IC17.2 IC17.3 | IC7.18 26.35,54.93 26.35,58.1 25.72,58.74 25.72,74.3 | 25.72,74.3 25.72,79.06 IC6.18 | IC31.2 IC31.3 | RN2.2 80.96,71.44 v80.96,74.3 80.96,101.28 79.69,102.55 77.15,102.55 77.15,100.65 IC23.2 IC23.3 | v26.04,74.3 25.72,74.3 | v88.58,28.89 88.58,59.69 85.09,63.18 v85.09,69.53
  Bottom 0.152: IC29.3 66.99,26.99 77.79,26.99 IC25.3 79.69,26.99 88.58,26.99 | IC19.3 141.29,28.89 123.51,28.89 122.87,28.26 117.16,28.26 IC13.3 115.25,27.94 114.3,26.99 88.58,26.99 | IC32.2 153.99,100.01 143.19,100.01 | IC17.2 143.19,100.01 | 143.19,100.01 117.79,100.01 IC11.2 113.67,99.06 112.71,100.01 77.79,100.01 | IC31.2 66.99,100.01 77.79,100.01 | IC23.2 77.79,100.01 | v80.96,74.3 v26.04,74.3 | v88.58,28.89 88.58,26.99 | v85.09,69.53 82.87,69.53 RN2.2
ADATA9  (via drill 0.33)
  Top 0.152: IC29.4 IC29.5 | IC25.5 IC25.4 76.52,27.62 v76.52,74.93 | IC13.4 IC13.5 | IC19.4 IC19.5 | IC11.4 IC11.5 | IC17.4 IC17.5 | IC7.17 28.26,55.56 28.26,74.93 | 28.26,74.93 28.26,77.79 29.21,78.74 IC6.17 | IC31.4 IC31.5 | RN2.3 82.87,72.07 v82.87,74.93 82.87,100.01 79.69,103.19 76.52,103.19 76.52,96.2 IC23.4 IC23.5 | v29.53,74.93 28.26,74.93
  Bottom 0.152: IC29.5 66.99,21.91 77.79,21.91 IC25.5 79.69,21.91 114.3,21.91 115.25,22.86 IC13.5 117.16,23.18 122.87,23.18 123.51,23.81 141.29,23.81 IC19.5 | IC32.4 153.99,94.93 143.19,94.93 | IC17.4 143.19,94.93 | 143.19,94.93 117.79,94.93 IC11.4 115.89,94.93 77.79,94.93 | IC31.4 66.99,94.93 77.79,94.93 | IC23.4 77.79,94.93 | v82.87,74.93 v76.52,74.93 v29.53,74.93
ADATA10  (via drill 0.33)
  Top 0.152: IC29.6 IC29.7 66.99,16.83 66.99,16.19 72.07,11.11 72.07,9.84 72.71,9.21 77.15,9.21 | IC25.6 IC25.7 77.15,16.19 77.15,9.21 | IC19.6 IC19.7 | v77.79,8.57 77.15,9.21 | v113.03,8.57 115.25,10.79 115.25,16.19 IC13.7 IC13.6 118.43,21.91 118.43,41.91 119.06,42.55 v119.06,61.28 | IC11.6 IC11.7 | IC17.6 IC17.7 | v32.7,57.15 32.7,77.47 31.75,78.42 IC6.16 | IC31.6 IC31.7 | IC23.6 IC23.7 77.15,84.77 77.15,78.11 v79.69,75.56 | v85.41,73.98 85.41,72.07 RN2.4 86.36,62.87 v87.95,61.28
  Bottom 0.152: IC13.7 117.79,18.73 141.29,18.73 IC19.7 | v113.03,8.57 v77.79,8.57 | IC32.6 153.99,89.85 143.19,89.85 | IC17.6 143.19,89.85 | 143.19,89.85 117.79,89.85 IC11.6 115.89,89.85 77.79,89.85 | IC7.16 31.75,57.15 v32.7,57.15 | v85.41,73.98 83.82,75.56 v79.69,75.56 | IC31.6 66.36,89.22 72.07,89.22 72.71,89.85 77.79,89.85 | IC23.6 77.79,89.85 | IC6.16 31.75,82.23 33.34,83.82 33.34,87.31 64.45,87.31 65.41,86.36 IC31.7 | v87.95,61.28 v119.06,61.28
ADATA11  (via drill 0.33)
  Top 0.152: IC29.8 IC29.9 | IC25.8 IC25.9 | IC13.8 IC13.9 | IC19.9 IC19.8 139.38,18.1 v139.38,79.38 | IC11.8 IC11.9 | IC17.8 IC17.9 | IC7.15 33.34,55.56 33.34,79.06 IC6.15 | IC31.8 IC31.9 | IC23.8 IC23.9 | RN2.5 88.58,71.44 v88.58,83.5
  Bottom 0.152: IC29.9 66.36,13.02 72.07,13.02 | 72.07,13.02 72.71,13.65 77.79,13.65 IC25.9 | 117.79,11.75 IC13.9 | 117.79,11.75 141.29,11.75 IC19.9 | 72.07,13.02 72.07,11.11 97.47,11.11 98.11,11.75 117.79,11.75 | IC32.8 153.99,84.77 143.19,84.77 | IC17.8 143.19,84.77 | 143.19,84.77 117.79,84.77 IC11.8 115.89,84.77 87.31,84.77 | 87.31,84.77 v88.58,83.5 | 79.69,84.77 87.31,84.77 | IC23.8 79.69,84.77 | IC31.8 71.75,83.82 72.71,84.77 79.69,84.77 | IC6.15 36.51,82.23 65.09,82.23 IC31.9 | v139.38,79.38 141.29,81.28 IC17.9
ADATA12  (via drill 0.33)
  Top 0.152: IC29.13 IC29.12 | IC25.13 IC25.12 | IC13.13 IC13.12 | IC19.13 IC19.12 | 46.04,58.42 v45.72,58.1 | 46.04,58.42 46.04,73.66 v44.13,75.56 | IC31.13 IC31.12 | IC23.13 IC23.12 87.95,79.69 87.95,69.53 89.85,69.53 RN2.6 | IC11.13 IC11.12 | IC17.13 IC17.12 | 46.04,58.42 v46.04,14.29
  Bottom 0.152: IC29.12 73.98,12.38 77.15,12.38 77.79,11.75 85.41,11.75 IC25.12 87.31,13.65 113.67,13.65 114.3,14.29 125.41,14.29 | 125.41,14.29 IC13.13 | 125.41,14.29 148.91,14.29 IC19.13 | IC7.14 40.32,58.1 v45.72,58.1 | v44.13,75.56 42.55,77.15 39.69,77.15 IC6.14 35.24,78.42 33.97,78.42 33.34,79.06 33.34,82.87 74.61,82.87 | 74.61,82.87 IC31.13 | 74.61,82.87 85.41,82.87 IC23.13 87.31,82.87 113.35,82.87 113.98,82.23 125.41,82.23 | IC32.11 160.97,80.33 150.81,80.33 IC17.12 148.91,82.23 125.41,82.23 | 125.41,82.23 IC11.12 | IC29.13 73.34,14.92 67.63,14.92 66.99,14.29 v46.04,14.29
ADATA13  (via drill 0.33)
  Top 0.152: IC7.13 38.42,55.56 38.42,75.25 39.37,76.2 IC6.13 | IC31.15 IC31.14 72.07,84.77 72.07,78.11 v71.12,77.15 | IC23.15 IC23.14 | RN2.7 93.66,71.44 v93.66,85.41 | IC11.15 IC11.14 126.05,84.77 126.05,21.91 IC13.15 IC13.14 | IC17.15 IC17.14 | IC29.14 IC29.15 75.88,22.54 v75.88,76.83 | IC25.15 IC25.14 | IC19.15 IC19.14
  Bottom 0.152: 87.31,85.41 v93.66,85.41 | IC23.14 87.31,85.41 | IC31.14 74.61,85.41 87.31,85.41 | IC6.13 41.59,77.79 69.85,77.79 70.48,77.15 v71.12,77.15 71.44,76.83 v75.88,76.83 | IC32.13 162.24,84.14 156.53,84.14 155.26,85.41 150.81,85.41 IC17.14 | IC11.15 125.41,87.95 148.91,87.95 IC17.15 | IC29.14 74.61,16.83 85.41,16.83 IC25.14 87.31,16.83 108.9,16.83 111.44,19.37 125.41,19.37 | 125.41,19.37 IC13.15 | 125.41,19.37 146.69,19.37 147.64,20.32 IC19.15
ADATA14  (via drill 0.33)
  Top 0.152: IC29.17 IC29.16 | IC25.17 IC25.16 | IC13.17 IC13.16 | IC19.17 IC19.16 | IC11.17 IC11.16 122.56,89.53 v122.56,89.22 | IC17.17 IC17.16 | IC7.12 41.59,54.93 41.59,57.47 40.96,58.1 40.96,79.06 IC6.12 39.05,82.87 v39.05,87.95 | IC31.17 IC31.16 72.07,89.85 72.07,88.9 v70.48,87.31 | 95.57,72.07 94.3,73.34 94.3,87.95 | 95.57,72.07 RN2.8 | v94.3,90.49 94.3,87.95 | IC23.16 IC23.17 | 94.3,87.95 v94.93,87.95 | 95.57,72.07 v95.57,25.72
  Bottom 0.152: IC29.16 74.61,23.81 85.41,23.81 IC25.16 | IC19.17 148.91,24.45 125.41,24.45 IC13.17 122.87,23.81 101.28,23.81 100.65,24.45 95.57,24.45 | IC25.17 86.68,25.08 89.85,25.08 90.49,24.45 95.57,24.45 | IC32.15 160.97,90.49 150.81,90.49 IC17.16 148.59,91.44 147.64,92.39 125.41,92.39 IC11.16 | v94.3,90.49 87.31,90.49 IC23.16 | IC31.17 73.98,93.66 77.15,93.66 77.79,93.03 84.14,93.03 85.09,93.98 IC23.17 | v39.05,87.95 64.45,87.95 65.09,87.31 v70.48,87.31 | v122.56,89.22 121.28,87.95 v94.93,87.95 | v95.57,25.72 95.57,24.45
ADATA15  (via drill 0.33)
  Top 0.152: IC29.18 IC29.19 75.25,32.07 75.25,94.93 IC31.18 IC31.19 | IC25.19 IC25.18 | IC13.19 IC13.18 | IC19.19 IC19.18 | IC11.19 IC11.18 | IC17.19 IC17.18 | IC7.11 44.13,54.93 44.13,58.1 43.5,58.74 43.5,79.06 44.13,79.69 | RN2.9 95.57,74.61 95.57,99.38 92.39,102.55 87.95,102.55 87.95,100.65 IC23.19 IC23.18 | 44.13,79.69 39.69,84.14 39.69,89.22 40.96,90.49 46.04,90.49 v46.04,95.57 | 44.13,79.69 IC6.11
  Bottom 0.152: IC29.18 74.61,28.89 85.41,28.89 IC25.18 | IC19.19 148.91,29.53 125.41,29.53 IC13.19 122.87,28.89 101.28,28.89 100.65,29.53 90.49,29.53 89.85,30.16 86.68,30.16 IC25.19 | IC32.17 160.97,95.57 150.81,95.57 IC17.18 148.91,97.47 125.41,97.47 IC11.18 123.51,97.47 109.54,97.47 108.9,98.11 87.31,98.11 IC23.19 | IC31.18 74.61,95.57 85.41,95.57 IC23.18 | v46.04,95.57 48.58,98.11 72.71,98.11 IC31.19
BUS-DIR  (via drill 0.33)
  Top 0.152: IC7.1 21.91,47.31 21.91,53.02 22.54,53.66 22.54,58.74 | IC5.1 22.54,58.74 | IC6.1 21.91,72.07 21.91,68.9 22.54,68.26 22.54,58.74 | IC2.11 30.8,107 32.7,107 32.7,103.19 28.26,98.74 28.26,78.42 v27.3,77.47
  Bottom 0.152: v27.3,77.47 22.23,72.39 IC6.1
CLK0H  (via drill 0.33)
  Top 0.152: 118.43,53.66 IC9.4 | v118.43,77.79 118.43,53.66 | v151.45,24.45 151.45,34.29 150.5,35.24 v150.5,41.59 | 118.43,53.66 v118.43,42.86
  Bottom 0.152: v118.43,77.79 119.38,78.74 IC11.11 | IC35.15 171.13,24.45 v151.45,24.45 | v150.5,41.59 149.22,42.86 v118.43,42.86
CLK0L  (via drill 0.33)
  Top 0.152: v113.98,62.55 IC9.1 | v110.17,62.55 110.17,77.15 IC10.11 | v154.31,31.75 153.35,32.7 153.35,43.5 152.72,44.13 v152.72,59.05
  Bottom 0.152: v110.17,62.55 v113.98,62.55 114.62,61.91 149.86,61.91 v152.72,59.05 | IC35.17 171.13,29.53 157.8,29.53 155.57,31.75 v154.31,31.75
CLK1H  (via drill 0.33)
  Top 0.152: v127.32,56.2 127.32,6.99 125.41,5.08 124.46,5.08 IC13.11
  Bottom 0.152: IC13.11 124.78,9.84 127.95,9.84 129.22,8.57 173.67,8.57 IC35.11 | IC9.13 125.41,56.2 v127.32,56.2
CLK1L  (via drill 0.33)
  Top 0.152: v113.35,48.26 113.35,11.75 IC12.11 111.76,8.89 v115.57,5.08 | IC35.13 168.28,8.26 v168.28,7.94
  Bottom 0.152: v113.35,48.26 113.67,48.58 123.51,48.58 IC9.10 | v168.28,7.94 165.42,5.08 v115.57,5.08
CLK2H  (via drill 0.33)
  Top 0.152: v133.67,56.2 IC15.4 | v149.86,64.14 IC17.11
  Bottom 0.152: v133.67,56.2 135.57,58.1 152.72,58.1 154.31,59.69 | 154.31,59.69 v149.86,64.14 | 154.31,59.69 IC34.4
CLK2L  (via drill 0.33)
  Top 0.152: IC15.1 130.49,60.64 v130.49,72.07 | IC34.2 156.53,66.36 156.53,67.63 153.99,70.17 v153.99,72.71
  Bottom 0.152: IC16.11 136.21,77.79 | 136.21,77.79 v130.49,72.07 | v153.99,72.71 148.91,77.79 136.21,77.79
CLK3H  (via drill 0.33)
  Top 0.152: IC19.11 152.08,12.38 v152.08,49.21
  Bottom 0.152: 152.4,49.53 v152.08,49.21 | IC34.8 152.4,49.53 | IC15.13 138.11,56.2 150.18,56.2 152.4,53.98 152.4,49.53
CLK3L
  Top 0.152: IC18.11 135.57,11.75 135.57,35.88 136.21,36.51 136.21,43.5 135.57,44.13 135.57,47.94 IC15.10
  Bottom 0.152: IC34.6 159.07,50.48 163.51,50.48 164.15,49.85 164.15,48.58 138.11,48.58 IC15.10
CLK4H  (via drill 0.33)
  Top 0.152: 80.33,53.66 82.23,55.56 v82.23,77.79 | 80.33,53.66 IC21.4 | v147.64,19.37 143.83,23.18 143.83,35.24 v140.65,38.42 | v82.23,38.42 80.33,40.32 80.33,53.66
  Bottom 0.152: v82.23,77.79 83.19,78.74 IC23.11 | IC35.6 166.69,19.37 v147.64,19.37 | v82.23,38.42 v140.65,38.42
CLK4L  (via drill 0.33)
  Top 0.152: IC21.1 79.69,60.64 v79.69,65.09 | 97.47,66.99 100.01,69.53 100.01,77.79 IC22.11 | 97.47,66.99 v96.2,65.72 | IC35.8 170.5,18.1 170.5,35.24 169.23,36.51 v169.23,38.1 | v98.42,40.32 96.84,41.91 96.84,62.55 97.47,63.18 97.47,66.99
  Bottom 0.152: v79.69,65.09 80.33,65.72 v96.2,65.72 | v169.23,38.1 168.28,39.05 140.97,39.05 139.7,40.32 v98.42,40.32
CLK5H  (via drill 0.33)
  Top 0.152: IC25.11 87.95,11.75 v87.95,41.59 87.95,55.56 IC21.13 | v169.86,31.11 169.86,35.24 168.59,36.51 v168.59,37.47 | v140.34,41.59 v143.51,38.42
  Bottom 0.152: IC35.2 168.28,31.11 v169.86,31.11 | v168.59,37.47 167.64,38.42 v143.51,38.42 | v87.95,41.59 v140.34,41.59
CLK5L  (via drill 0.33)
  Top 0.152: IC24.11 97.47,11.75 97.47,39.37 96.2,40.64 v96.2,48.58 | IC35.4 166.05,23.81 v166.05,7.3
  Bottom 0.152: v96.2,48.58 87.31,48.58 IC21.10 | v166.05,7.3 128.27,7.3 126.36,9.21 100.01,9.21 IC24.11
CLK6H  (via drill 0.33)
  Top 0.152: IC29.11 67.63,16.19 67.63,37.47 | 67.63,37.47 67.63,50.16 66.04,51.75 IC27.4 | v156.84,49.53 156.53,49.21 v156.53,40.32 | 67.63,37.47 v71.12,40.96
  Bottom 0.152: v156.84,49.53 IC34.13 | v156.53,40.32 140.34,40.32 139.7,40.96 v71.12,40.96
CLK6L  (via drill 0.33)
  Top 0.152: IC28.11 59.37,11.75 v59.37,39.69 59.37,50.48 58.74,51.12 58.74,60.96 v61.91,64.14 | v64.45,64.14 66.04,62.55 IC27.1 | v141.29,39.69 140.02,39.69 v140.02,39.05
  Bottom 0.152: v64.45,64.14 v61.91,64.14 | IC34.11 157.8,39.69 v141.29,39.69 | v140.02,39.05 139.38,39.69 v59.37,39.69
CLK7H  (via drill 0.33)
  Top 0.152: IC27.13 72.07,58.74 72.07,67.31 v73.66,68.9 IC31.11 | IC34.17 160.97,61.28 v160.97,69.22
  Bottom 0.152: v160.97,69.22 160.02,70.17 159.7,70.17 157.8,72.07 151.13,72.07 150.18,71.12 113.67,71.12 113.03,70.48 109.86,70.48 108.27,68.9 v73.66,68.9
CLK7L  (via drill 0.33)
  Top 0.152: v63.18,48.58 63.18,68.26 61.28,70.17 61.28,78.42 IC30.11 | IC34.15 160.97,53.02 v160.97,45.4 | v82.23,42.86 80.96,44.13 v80.96,48.58
  Bottom 0.152: 72.71,48.58 IC27.10 | v63.18,48.58 72.71,48.58 | v160.97,45.4 156.53,40.96 141.92,40.96 140.65,42.23 93.03,42.23 92.39,42.86 v82.23,42.86 | 72.71,48.58 v80.96,48.58
DATA0
  Top 0.152: IC7.2 24.13,52.7 23.18,53.66 23.18,57.15 24.13,58.1 IC5.2
  Bottom 0.152: X1.A19 6.35,58.42 15.56,58.42 15.88,58.74 20.64,58.74 21.27,58.1 22.23,58.1 23.81,59.69 IC5.2
DATA1
  Top 0.152: IC7.3 26.99,47.31 26.99,53.02 27.62,53.66 27.62,58.74 IC5.3
  Bottom 0.152: X1.A20 6.35,60.96 16.51,60.96 16.83,60.64 20.64,60.64 21.27,61.28 25.08,61.28 IC5.3
DATA2
  Top 0.152: IC7.4 30.16,47.94 30.16,58.74 IC5.4
  Bottom 0.152: X1.A21 5.71,64.14 6.67,64.14 7.3,63.5 14.61,63.5 16.83,61.28 20.64,61.28 21.27,61.91 26.99,61.91 IC5.4
DATA3  (via drill 0.33)
  Top 0.152: IC7.5 32.07,47.31 32.07,53.02 32.7,53.66 32.7,56.2 31.75,57.15 IC5.5 31.75,62.87 v31.43,63.18
  Bottom 0.152: X1.A22 6.35,68.58 18.41,68.58 23.81,63.18 v31.43,63.18
DATA4  (via drill 0.33)
  Top 0.152: IC7.6 35.24,47.94 35.24,53.02 | 35.24,53.02 35.24,58.74 IC5.6 | 35.24,53.02 v33.34,53.02
  Bottom 0.152: X1.A23 3.17,67.94 3.17,56.52 4.13,56.52 4.76,55.88 18.41,55.88 21.27,53.02 v33.34,53.02
DATA5  (via drill 0.33)
  Top 0.152: IC7.7 35.88,47.94 v35.88,57.47 | v15.24,73.66 16.19,72.71 v16.19,58.1
  Bottom 0.152: 35.88,57.78 35.88,59.69 IC5.7 | X1.A24 6.35,73.66 v15.24,73.66 | v16.19,58.1 17.78,56.52 30.48,56.52 31.75,57.78 35.88,57.78 | 35.88,57.78 v35.88,57.47
DATA6  (via drill 0.33)
  Top 0.152: IC7.8 40.32,47.94 40.32,56.83 39.37,57.78 IC5.8 | v20,66.04 v20,76.2
  Bottom 0.152: X1.A25 6.35,76.2 v20,76.2 | v20,66.04 23.5,62.55 36.51,62.55 IC5.8
DATA7  (via drill 0.33)
  Top 0.152: IC7.9 42.86,47.94 42.86,56.83 41.91,57.78 IC5.9 | X1.A26 3.81,76.2 v3.81,55.88
  Bottom 0.152: v3.81,55.88 3.81,48.26 20.95,48.26 21.27,48.58 40.32,48.58 IC7.9
DATA8  (via drill 0.33)
  Top 0.152: IC6.2 23.81,72.71 v23.81,74.93
  Bottom 0.152: v23.81,74.93 20,78.74 6.35,78.74 X1.A27
DATA9  (via drill 0.33)
  Top 0.152: IC6.3 26.67,77.15 v26.35,77.47
  Bottom 0.152: v26.35,77.47 26.04,77.79 21.59,77.79 18.1,81.28 6.35,81.28 X1.A28
DATA10  (via drill 0.33)
  Top 0.152: IC6.4 30.16,73.34 v30.16,83.19
  Bottom 0.152: v30.16,83.19 29.84,83.5 10.79,83.5 10.48,83.82 6.35,83.82 X1.A29
DATA11
  Bottom 0.152: IC6.5 30.16,70.8 10.79,70.8 10.48,71.12 4.76,71.12 3.81,72.07 3.81,87.63 X1.A30
DATA12  (via drill 0.33)
  Top 0.152: v46.67,70.48 46.67,46.67 47.31,46.04 v47.31,18.73
  Bottom 0.152: IC6.6 36.2,70.48 v46.67,70.48 | v47.31,18.73 36.51,18.73 36.2,18.41 27.94,18.41 27.62,18.73 11.43,18.73 10.48,17.78 8.89,17.78 X1.B3
DATA13  (via drill 0.33)
  Top 0.152: IC6.7 35.88,71.44 35.88,58.42 36.51,57.78 v36.51,56.52 | v23.5,52.39 22.54,51.44 v22.54,20
  Bottom 0.152: v36.51,56.52 35.24,55.24 35.24,52.39 v23.5,52.39 | v22.54,20 10.79,20 10.48,20.32 8.89,20.32 X1.B4
DATA14  (via drill 0.33)
  Top 0.152: IC6.8 40.32,71.44 40.32,57.47 40.96,56.83 40.96,29.21 v37.47,25.72
  Bottom 0.152: v37.47,25.72 37.15,25.4 8.89,25.4 X1.B5
DATA15  (via drill 0.33)
  Top 0.152: IC6.9 42.86,71.44 42.86,57.47 43.5,56.83 v43.5,45.09 | v13.65,29.84 v13.65,37.47
  Bottom 0.152: v43.5,45.09 42.55,44.13 20.32,44.13 v13.65,37.47 | v13.65,29.84 11.75,27.94 8.89,27.94 X1.B6
FP-ADATA0  (via drill 0.33)
  Top 0.152: v145.73,98.11 v145.73,28.89
  Bottom 0.152: IC33.18 161.61,28.89 v145.73,28.89 | v145.73,98.11 169.23,98.11 JP1.3
FP-ADATA1  (via drill 0.33)
  Top 0.152: v147.64,23.81 146.37,25.08 146.37,92.39 149.54,95.57 151.45,95.57 151.45,110.81 152.4,111.76 170.18,111.76 170.18,99.06 JP1.5
  Bottom 0.152: IC33.16 161.61,23.81 v147.64,23.81
FP-ADATA2  (via drill 0.33)
  Top 0.152: IC33.14 165.42,20.64 165.42,25.08 167.32,26.99 169.23,26.99 169.23,35.24 167.96,36.51 v167.96,40.96 | v157.16,46.04 157.16,48.9 157.8,49.53 157.8,66.99 156.53,68.26 156.53,74.61 162.24,80.33 166.05,80.33 166.05,89.85 JP1.7
  Bottom 0.152: v167.96,40.96 162.88,46.04 v157.16,46.04
FP-ADATA3  (via drill 0.33)
  Top 0.152: IC33.12 160.97,14.29 160.97,44.45 160.34,45.09 160.34,70.17 166.69,76.52 v166.69,78.11
  Bottom 0.152: v166.69,78.11 167.32,78.74 174.31,78.74 176.53,80.96 176.53,96.52 173.67,96.52 172.72,95.57 172.72,92.71 JP1.9
FP-ADATA4  (via drill 0.33)
  Top 0.152: IC33.9 151.45,9.21 148.27,9.21 148.27,35.88 148.91,36.51 148.91,43.5 147.64,44.77 147.64,62.55 148.27,63.18 v148.27,92.71
  Bottom 0.152: v148.27,92.71 148.59,92.39 159.7,92.39 162.24,89.85 171.13,89.85 JP1.11
FP-ADATA5  (via drill 0.33)
  Top 0.152: v158.12,18.1 159.07,19.05 159.07,48.9 159.7,49.53 v159.7,53.66 | v167.96,56.2 169.54,57.78 169.54,82.23 171.13,83.82 172.72,83.82 172.72,86.36 JP1.13
  Bottom 0.152: IC33.7 155.26,18.1 v158.12,18.1 | v159.7,53.66 162.24,56.2 v167.96,56.2
FP-ADATA6  (via drill 0.33)
  Top 0.152: v158.12,23.18 158.43,23.5 158.43,48.9 159.07,49.53 159.07,72.71 166.69,80.33 166.69,81.28 170.5,85.09 JP1.15
  Bottom 0.152: IC33.5 155.26,23.18 v158.12,23.18
FP-ADATA7  (via drill 0.33)
  Top 0.152: IC33.3 152.72,30.16 v152.72,34.61 | v166.69,35.24 167.32,35.88 v167.32,80.96
  Bottom 0.152: v152.72,34.61 153.35,35.24 v166.69,35.24 | v167.32,80.96 168.91,82.55 JP1.17
FP-ADATA8
  Bottom 0.152: IC32.18 163.51,97.47 169.54,97.47 171.13,99.06 172.72,99.06 JP1.4
FP-ADATA9
  Bottom 0.152: IC32.16 167.64,96.52 172.72,96.52 JP1.6
FP-ADATA10
  Bottom 0.152: IC32.14 174.31,86.36 175.26,87.31 175.26,88.9 173.67,88.9 172.72,89.85 172.72,90.81 173.04,90.81 173.67,91.44 174.31,91.44 175.26,92.39 175.26,95.25 JP1.8
FP-ADATA11  (via drill 0.33)
  Top 0.152: IC32.12 165.42,84.14 v165.42,90.49
  Bottom 0.152: v165.42,90.49 166.37,91.44 172.72,91.44 JP1.10
FP-ADATA12
  Bottom 0.152: IC32.9 155.26,80.96 160.97,80.96 161.61,80.33 170.18,80.33 171.13,81.28 174.31,81.28 175.9,82.87 175.9,90.17 JP1.12
FP-ADATA13
  Bottom 0.152: IC32.7 156.53,87.95 170.18,87.95 171.13,88.9 172.72,88.9 JP1.14
FP-ADATA14  (via drill 0.33)
  Top 0.152: v161.29,85.09 IC32.5
  Bottom 0.152: v161.29,85.09 161.61,84.77 170.18,84.77 171.13,83.82 172.72,83.82 JP1.16
FP-ADATA15
  Top 0.152: IC32.3 160.97,96.52 160.97,96.84 161.61,97.47 170.18,97.47 171.13,96.52 175.26,96.52 175.26,83.82 JP1.18
FP-CLK0H  (via drill 0.33)
  Top 0.152: v172.4,22.23 173.67,23.5 173.67,35.88 174.94,37.15 174.94,53.34 175.9,54.29 175.9,75.56 v175.26,76.2
  Bottom 0.152: IC35.5 168.28,22.23 v172.4,22.23 | v175.26,76.2 172.72,76.2 JP1.23
FP-CLK0L  (via drill 0.33)
  Top 0.152: v164.78,70.8 v164.78,28.89
  Bottom 0.152: IC35.3 166.69,28.89 v164.78,28.89 | v164.78,70.8 166.37,72.39 JP1.25
FP-CLK1H
  Top 0.152: IC35.9 171.13,16.19 171.13,33.97 174.31,37.15 174.31,53.34 175.26,54.29 175.26,75.25 174.31,76.2 172.72,76.2 172.72,78.74 JP1.19
FP-CLK1L  (via drill 0.33)
  Top 0.152: v156.84,18.73 156.53,19.05 156.53,39.37 157.8,40.64 157.8,48.9 158.43,49.53 v158.43,73.66
  Bottom 0.152: IC35.7 166.69,18.73 v156.84,18.73 | v158.43,73.66 162.24,77.47 JP1.21
FP-CLK2H  (via drill 0.33)
  Top 0.152: v170.81,60.96 172.09,60.96 172.09,61.28 172.72,61.91 172.72,73.66 JP1.24
  Bottom 0.152: IC34.16 162.88,57.47 167.32,57.47 v170.81,60.96
FP-CLK2L  (via drill 0.33)
  Top 0.152: IC34.18 164.15,63.82 v164.15,69.22
  Bottom 0.152: v164.15,69.22 166.05,71.12 172.72,71.12 JP1.26
FP-CLK3H  (via drill 0.33)
  Top 0.152: v167.96,47.31 170.18,49.53 170.18,80.33 171.13,81.28 173.99,81.28 JP1.20
  Bottom 0.152: IC34.12 162.88,47.31 v167.96,47.31
FP-CLK3L  (via drill 0.33)
  Top 0.152: v175.58,53.02 176.53,53.98 176.53,75.88 174.94,77.47 JP1.22
  Bottom 0.152: IC34.14 163.51,53.02 v175.58,53.02
FP-CLK4H  (via drill 0.33)
  Top 0.152: v164.78,21.59 164.15,22.23 v164.15,58.74
  Bottom 0.152: IC35.14 171.45,21.59 v164.78,21.59 | v164.15,58.74 170.18,64.77 JP1.31
FP-CLK4L  (via drill 0.33)
  Top 0.152: v171.77,33.66 v171.77,16.19
  Bottom 0.152: v171.77,16.19 IC35.12 | v171.77,33.66 176.21,38.1 176.21,60.96 172.72,60.96 JP1.33
FP-CLK5H  (via drill 0.33)
  Top 0.152: v167.32,31.75 166.05,31.75 v166.05,69.22
  Bottom 0.152: IC35.18 171.45,31.75 v167.32,31.75 | v166.05,69.22 166.69,69.85 JP1.27
FP-CLK5L  (via drill 0.33)
  Top 0.152: v166.05,26.99 165.42,27.62 v165.42,64.45
  Bottom 0.152: IC35.16 171.13,26.99 v166.05,26.99 | v165.42,64.45 168.28,67.31 JP1.29
FP-CLK6H
  Bottom 0.152: IC34.7 153.35,53.66 153.35,58.1 165.74,58.1 171.13,63.5 172.72,63.5 JP1.32
FP-CLK6L  (via drill 0.33)
  Top 0.152: v170.81,52.39 172.72,54.29 172.72,60.96 JP1.34
  Bottom 0.152: IC34.9 155.89,47.94 164.47,47.94 168.91,52.39 v170.81,52.39
FP-CLK7H
  Bottom 0.152: IC34.3 151.45,65.72 151.45,68.58 172.72,68.58 JP1.28
FP-CLK7L  (via drill 0.33)
  Top 0.152: v157.16,59.37 IC34.5
  Bottom 0.152: v157.16,59.37 161.61,63.82 168.59,63.82 170.81,66.04 172.72,66.04 JP1.30
GND  (via drill 0.33)
  Top 0.152: IC38.8 40.32,85.41 40.32,89.22 40.96,89.85 46.67,89.85 46.67,105.09 C9.2 | JP1.40 172.72,53.34 C23.2 | IC6.10 45.4,71.44 45.4,60.64 IC5.10 44.45,58.42 45.4,57.47 45.4,53.66 44.77,53.02 44.77,47.31 IC7.10 | 109.22,71.12 C38.2 | C12.2 109.22,71.12 | C1.2 C6.2 | 109.22,71.12 C24.2 | IC2.5 IC2.4 | X1.A32 X1.B32 X1.C32 | C22.2 16.83,101.92 v16.83,97.79 16.83,95.89 17.78,94.93 C8.2 16.83,89.22 16.83,83.82 17.78,82.87 C14.2 16.83,76.52 16.83,63.82 | IC40.7 36.83,27.3 37.78,28.26 37.78,33.34 IC1.7 | X1.C1 X1.B1 | 16.83,38.42 16.83,27.62 C37.2 18.73,25.72 18.73,14.92 C27.2 | C32.2 16.83,38.42 | 16.83,51.12 C34.2 | 16.83,38.42 16.83,51.12 | 16.83,63.82 C31.2 | 16.83,51.12 16.83,63.82 | PWR.K 167.64,3.81 IC35.10 | C4.2 96.2,36.51 96.2,14.92 IC24.10
  Bottom 0.152: IC39.7 38.1,83.82 IC38.8 | C9.2 47.94,106.36 57.47,106.36 | C11.2 57.47,106.36 | 57.47,106.36 70.17,106.36 C13.2 72.07,104.46 82.87,104.46 | 82.87,104.46 C15.2 | 95.57,104.46 C2.2 | 82.87,104.46 95.57,104.46 | 108.27,104.46 C24.2 | 95.57,104.46 108.27,104.46 | 120.97,104.46 C26.2 | 108.27,104.46 120.97,104.46 | 120.97,104.46 133.67,104.46 C28.2 135.57,106.36 146.37,106.36 | 146.37,106.36 C10.2 | 146.37,106.36 159.07,106.36 C29.2 166.37,105.41 J1.2 | JP1.40 JP1.39 | C5.2 59.37,35.88 70.17,35.88 | C7.2 70.17,35.88 | 82.87,35.88 C6.2 | 70.17,35.88 82.87,35.88 | 95.57,35.88 C4.2 | 82.87,35.88 95.57,35.88 | 108.27,35.88 C36.2 | 95.57,35.88 108.27,35.88 | 120.97,35.88 C35.2 | 108.27,35.88 120.97,35.88 | 133.67,35.88 C16.2 | 120.97,35.88 133.67,35.88 | 146.37,35.88 C18.2 | 133.67,35.88 146.37,35.88 | 159.07,35.88 C25.2 | 146.37,35.88 159.07,35.88 | C23.2 171.77,35.88 159.07,35.88 | 128.59,43.5 117.79,43.5 IC9.7 115.57,43.18 105.41,43.18 IC8.7 103.19,43.5 90.49,43.5 | IC15.7 128.59,43.5 | 141.29,43.5 IC14.7 | 128.59,43.5 141.29,43.5 | IC34.10 153.99,43.5 141.29,43.5 | IC7.10 46.35,45.09 52.7,45.09 IC26.7 59.05,44.45 60.01,45.4 65.09,45.4 IC27.7 66.67,43.81 72.39,43.81 72.71,43.5 79.69,43.5 | 79.69,43.5 IC21.7 | 90.49,43.5 79.69,43.5 | IC20.7 90.49,43.5 | 59.37,62.55 C19.2 | 70.17,62.55 59.37,62.55 | C3.2 70.17,62.55 | 82.87,62.55 C1.2 | 70.17,62.55 82.87,62.55 | 82.87,62.55 95.57,62.55 C17.2 97.47,62.55 108.27,62.55 C12.2 113.98,63.5 114.94,62.55 120.97,62.55 C33.2 122.87,62.55 133.67,62.55 | IC5.10 44.45,62.55 59.37,62.55 | IC30.10 54.29,79.69 65.09,79.69 | IC31.10 65.09,79.69 | 77.79,79.69 IC23.10 | 65.09,79.69 77.79,79.69 | 77.79,79.69 90.49,79.69 IC22.10 92.39,77.79 104.14,77.79
  Bottom 0.152: C20.2 133.99,62.87 | 133.99,62.87 133.67,62.55 | 133.99,62.87 IC36.8 | C30.2 146.37,62.55 133.67,62.55 | 151.45,79.69 153.99,79.69 IC32.10 | 151.45,79.69 143.19,79.69 IC17.10 139.06,78.74 138.11,79.69 132.08,79.69 131.13,78.74 IC16.10 128.59,79.69 117.79,79.69 IC11.10 115.89,77.79 104.14,77.79 | 151.45,79.69 C21.2 | 104.14,77.79 104.14,73.34 107,73.34 C38.2 | 104.14,77.79 IC10.10 | IC2.7 35.24,99.38 33.34,99.38 | IC2.5 33.34,99.38 | 33.34,99.38 25.72,99.38 IC2.2 IC2.1 v16.83,97.79 | C8.2 15.24,92.71 X1.C32 | IC40.13 25.72,27.62 27.62,27.62 IC40.11 IC1.6 | IC1.6 IC1.5 | IC1.7 IC1.6 | X1.B1 X1.A1 | X1.C1 C27.2 21.27,10.48 37.78,10.48 IC37.8 40.64,10.16 IC28.10 54.29,11.11 65.09,11.11 IC29.10 66.99,9.21 77.79,9.21 | IC40.7 36.83,24.77 37.47,24.77 38.1,25.4 38.1,26.35 18.1,26.35 C37.2 | 77.79,9.21 IC25.10 | 77.79,9.21 90.49,9.21 IC24.10 91.76,10.48 97.47,10.48 98.11,11.11 105.09,11.11 | 105.09,11.11 IC12.10 | 115.89,11.11 105.09,11.11 | IC13.10 115.89,11.11 | 128.59,11.11 IC18.10 | 115.89,11.11 128.59,11.11 | 141.29,11.11 IC19.10 | 128.59,11.11 141.29,11.11 | 153.99,11.11 IC33.10 | 141.29,11.11 153.99,11.11 | IC35.10 166.69,11.11 153.99,11.11
N$1
  Top 0.152: IC8.3 105.73,56.2 105.73,62.55 103.19,65.09 103.19,77.79 102.55,78.42 102.55,100.01 IC10.1
N$2
  Top 0.152: IC1.10 30.8,42.86 30.8,91.76 IC39.10
  Bottom 0.152: IC39.12 28.26,94.3 30.16,94.3 IC39.10
N$5
  Bottom 0.152: R2.1 166.05,4.76 174.31,4.76 PWR.A
N$6  (via drill 0.33)
  Top 0.152: IC39.3 27.62,86.04 v27.62,87.31 | v75.88,91.12 76.52,90.49 76.52,75.88 79.69,72.71 v79.69,67.63
  Bottom 0.152: v27.62,87.31 30.8,90.49 46.67,90.49 48.58,92.39 74.61,92.39 v75.88,91.12 | v79.69,67.63 80.33,66.99 111.44,66.99 IC36.1
N$7
  Top 0.152: IC39.6 37.78,88.58 37.78,94.3 41.59,98.11 46.04,98.11 46.04,105.73 50.48,110.17 111.76,110.17 111.76,104.78 115.25,101.28 115.25,78.42 115.89,77.79 115.89,71.75 117.47,70.17 117.47,69.53 117.16,69.22 114.94,69.22 114.94,71.12 114.3,71.75 IC36.15
N$8
  Top 0.152: R1.1 154.94,107.95 IC32.1 153.35,100.01 153.35,68.9 | 153.35,68.9 IC34.1 | IC33.1 153.99,33.97 153.99,43.5 153.35,44.13 153.35,68.9
  Bottom 0.152: IC33.1 157.48,30.48 IC33.19 165.1,30.48 167,32.38 | 167,32.38 IC35.1 | IC35.19 173.35,32.38 167,32.38 | IC34.1 157.48,64.77 IC34.19 | IC32.1 157.48,99.06 IC32.19 | R1.1 J1.1
N$10
  Top 0.152: IC20.3 93.03,56.2 93.03,100.01 IC22.1
N$12  (via drill 0.33)
  Top 0.152: IC12.1 105.73,34.61 105.73,42.55 v107,43.81
  Bottom 0.152: v107,43.81 107.63,44.45 IC8.8
N$14  (via drill 0.33)
  Top 0.152: v116.84,69.85 115.25,71.44 115.25,77.79 113.98,79.06 v113.98,99.69 | J2.1 3.81,3.81 3.81,6.35 5.08,7.62 5.08,11.43 2.54,13.97 2.54,93.98 5.08,96.52 5.08,106.68 J3.1
  Bottom 0.152: v116.84,69.85 IC36.4 | v113.98,99.69 113.03,100.65 62.55,100.65 61.91,100.01 19.37,100.01 16.19,103.19 8.57,103.19 J3.1
N$15  (via drill 0.33)
  Top 0.152: v138.75,53.66 138.75,75.25 131.13,82.87 131.13,100.01 IC16.1
  Bottom 0.152: IC14.3 141.29,53.66 v138.75,53.66
N$16  (via drill 0.33)
  Top 0.152: v114.3,70.48 113.35,71.44 113.35,102.55 v108.9,107 | v81.28,3.17 89.85,11.75 89.85,40.96 94.3,45.4 94.3,62.55 94.93,63.18 v94.93,67.63